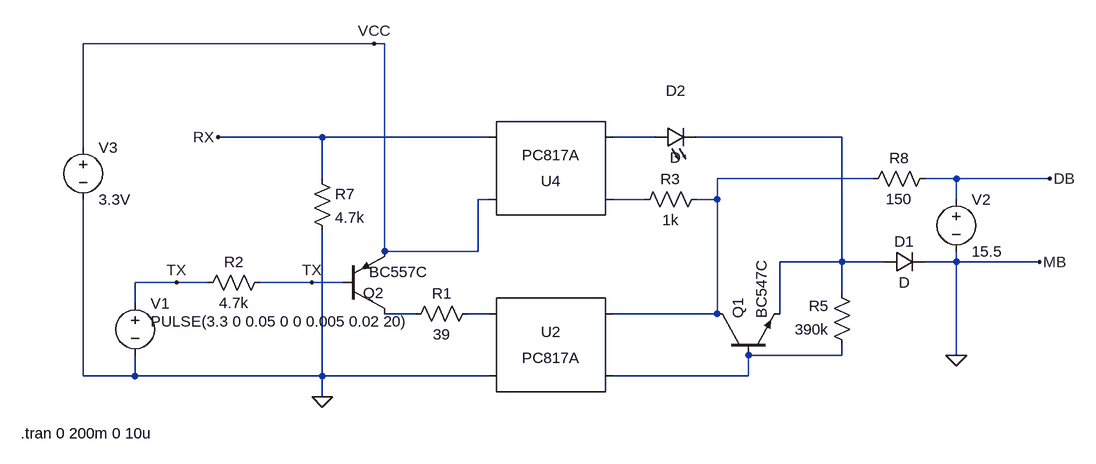
[diagram p0: schematic LPB_Adapter.asc]
LPB_Adapter.asc, the LTspice schematic file:
Version 4.1
SHEET 1 1864 680
WIRE 384 -608 -64 -608
WIRE 400 -608 384 -608
WIRE 304 -464 144 -464
WIRE 560 -464 304 -464
WIRE 816 -464 752 -464
WIRE 1104 -464 880 -464
WIRE -64 -448 -64 -608
WIRE 304 -400 304 -464
WIRE 1152 -400 912 -400
WIRE 1280 -400 1232 -400
WIRE 1424 -400 1280 -400
WIRE 560 -368 544 -368
WIRE 800 -368 752 -368
WIRE 912 -368 912 -400
WIRE 912 -368 880 -368
WIRE 1280 -368 1280 -400
WIRE 400 -288 400 -608
WIRE 544 -288 544 -368
WIRE 544 -288 400 -288
WIRE 1104 -272 1104 -464
WIRE 1104 -272 1008 -272
WIRE 1168 -272 1104 -272
WIRE 1280 -272 1280 -288
WIRE 1280 -272 1232 -272
WIRE 1408 -272 1280 -272
WIRE 80 -240 16 -240
WIRE 128 -240 80 -240
WIRE 288 -240 208 -240
WIRE 336 -240 288 -240
WIRE 1104 -224 1104 -272
WIRE 16 -208 16 -240
WIRE 448 -192 400 -192
WIRE 560 -192 528 -192
WIRE 912 -192 912 -368
WIRE 912 -192 752 -192
WIRE 1008 -192 1008 -272
WIRE 1104 -128 1104 -144
WIRE 1104 -128 960 -128
WIRE 1280 -128 1280 -272
WIRE -64 -96 -64 -368
WIRE 16 -96 16 -128
WIRE 16 -96 -64 -96
WIRE 304 -96 304 -320
WIRE 304 -96 16 -96
WIRE 560 -96 304 -96
WIRE 960 -96 960 -128
WIRE 960 -96 752 -96
WIRE 304 -64 304 -96
FLAG 304 -64 0
FLAG 288 -240 TX
FLAG 144 -464 RX
FLAG 384 -608 VCC
FLAG 1424 -400 DB
FLAG 1408 -272 MB
FLAG 1280 -128 0
FLAG 80 -240 TX
SYMBOL res 432 -176 R270
WINDOW 0 32 56 VTop 2
WINDOW 3 0 56 VBottom 2
SYMATTR InstName R1
SYMATTR Value 39
SYMBOL res 112 -224 R270
WINDOW 0 32 56 VTop 2
WINDOW 3 0 56 VBottom 2
SYMATTR InstName R2
SYMATTR Value 4.7k
SYMBOL res 784 -352 R270
WINDOW 0 32 56 VTop 2
WINDOW 3 0 56 VBottom 2
SYMATTR InstName R3
SYMATTR Value 1k
SYMBOL diode 1168 -256 R270
WINDOW 0 32 32 VTop 2
WINDOW 3 0 32 VBottom 2
SYMATTR InstName D1
SYMBOL npn 912 -128 R270
SYMATTR InstName Q1
SYMATTR Value BC547C
SYMBOL pnp 336 -192 M180
WINDOW 0 31 32 Left 2
WINDOW 3 40 64 Left 2
SYMATTR InstName Q2
SYMATTR Value BC557C
SYMBOL LED 816 -448 R270
WINDOW 0 72 32 VTop 2
WINDOW 3 0 32 VBottom 2
SYMATTR InstName D2
SYMBOL res 1120 -128 R180
WINDOW 0 36 76 Left 2
WINDOW 3 36 40 Left 2
SYMATTR InstName R5
SYMATTR Value 390k
SYMBOL res 288 -416 R0
SYMATTR InstName R7
SYMATTR Value 4.7k
SYMBOL voltage 16 -224 R0
WINDOW 3 24 44 Left 2
WINDOW 123 0 0 Left 0
WINDOW 39 0 0 Left 0
SYMATTR Value PULSE(3.3 0 0.05 0 0 0.005 0.02 20)
SYMATTR InstName V1
SYMBOL voltage -64 -464 R0
WINDOW 123 0 0 Left 0
WINDOW 39 0 0 Left 0
SYMATTR InstName V3
SYMATTR Value 3.3V
SYMBOL voltage 1280 -384 R0
WINDOW 123 0 0 Left 0
WINDOW 39 0 0 Left 0
SYMATTR InstName V2
SYMATTR Value 15.5
SYMBOL res 1248 -416 R90
WINDOW 0 0 56 VBottom 2
WINDOW 3 32 56 VTop 2
SYMATTR InstName R8
SYMATTR Value 150
SYMBOL Optos\\PC817A 656 -144 R0
SYMATTR InstName U2
SYMBOL Optos\\PC817A 656 -416 R180
SYMATTR InstName U4
TEXT -160 -8 Left 2 !.tran 0 200m 0 10u

The netlist it stands for:
* LPB_Adapter.asc
R1 N005 N006 39
R2 TX TX 4.7k
R3 N004 N003 1k
D1 N002 0 D
Q1 N003 N007 N002 0 BC547C
Q2 N005 TX VCC 0 BC557C
D2 N001 N002 D
R5 N007 N002 390k
R7 RX 0 4.7k
V1 TX 0 PULSE(3.3 0 0.05 0 0 0.005 0.02 20)
V3 VCC 0 3.3V
V2 DB 0 15.5
R8 DB N003 150
X§U2 N006 0 N003 N007 PC817 Igain=1m
X§U4 N004 N001 VCC RX PC817 Igain=1m
.model D D
.lib standard.dio
.model NPN NPN
.model PNP PNP
.lib standard.bjt
.tran 0 200m 0 10u
.lib PC817.sub
.backanno
.end